# Altium schematic sheet [02] - BLOCK DIAGRAM.SchDoc
size A2; DocumentNumber: 2; SheetNumber: 2; SheetTotal: 5; PageSetup: Record=PageOptions|CenterHorizontal=True|CenterVertical=True|PrintScale=0.52|XCorrection=1.00|YCorrection=1.00|PrintKind=1|BorderSize=5000000|LeftOffset=0|BottomOffset=0|Orientation=2|PaperLength=1000|PaperWidth=1000|Scale=100|PaperSource=4|PrintQuality=600|MediaType=1|DitherType=10|PrintScaleMode=1|PaperKind=A4|PaperIndex=9
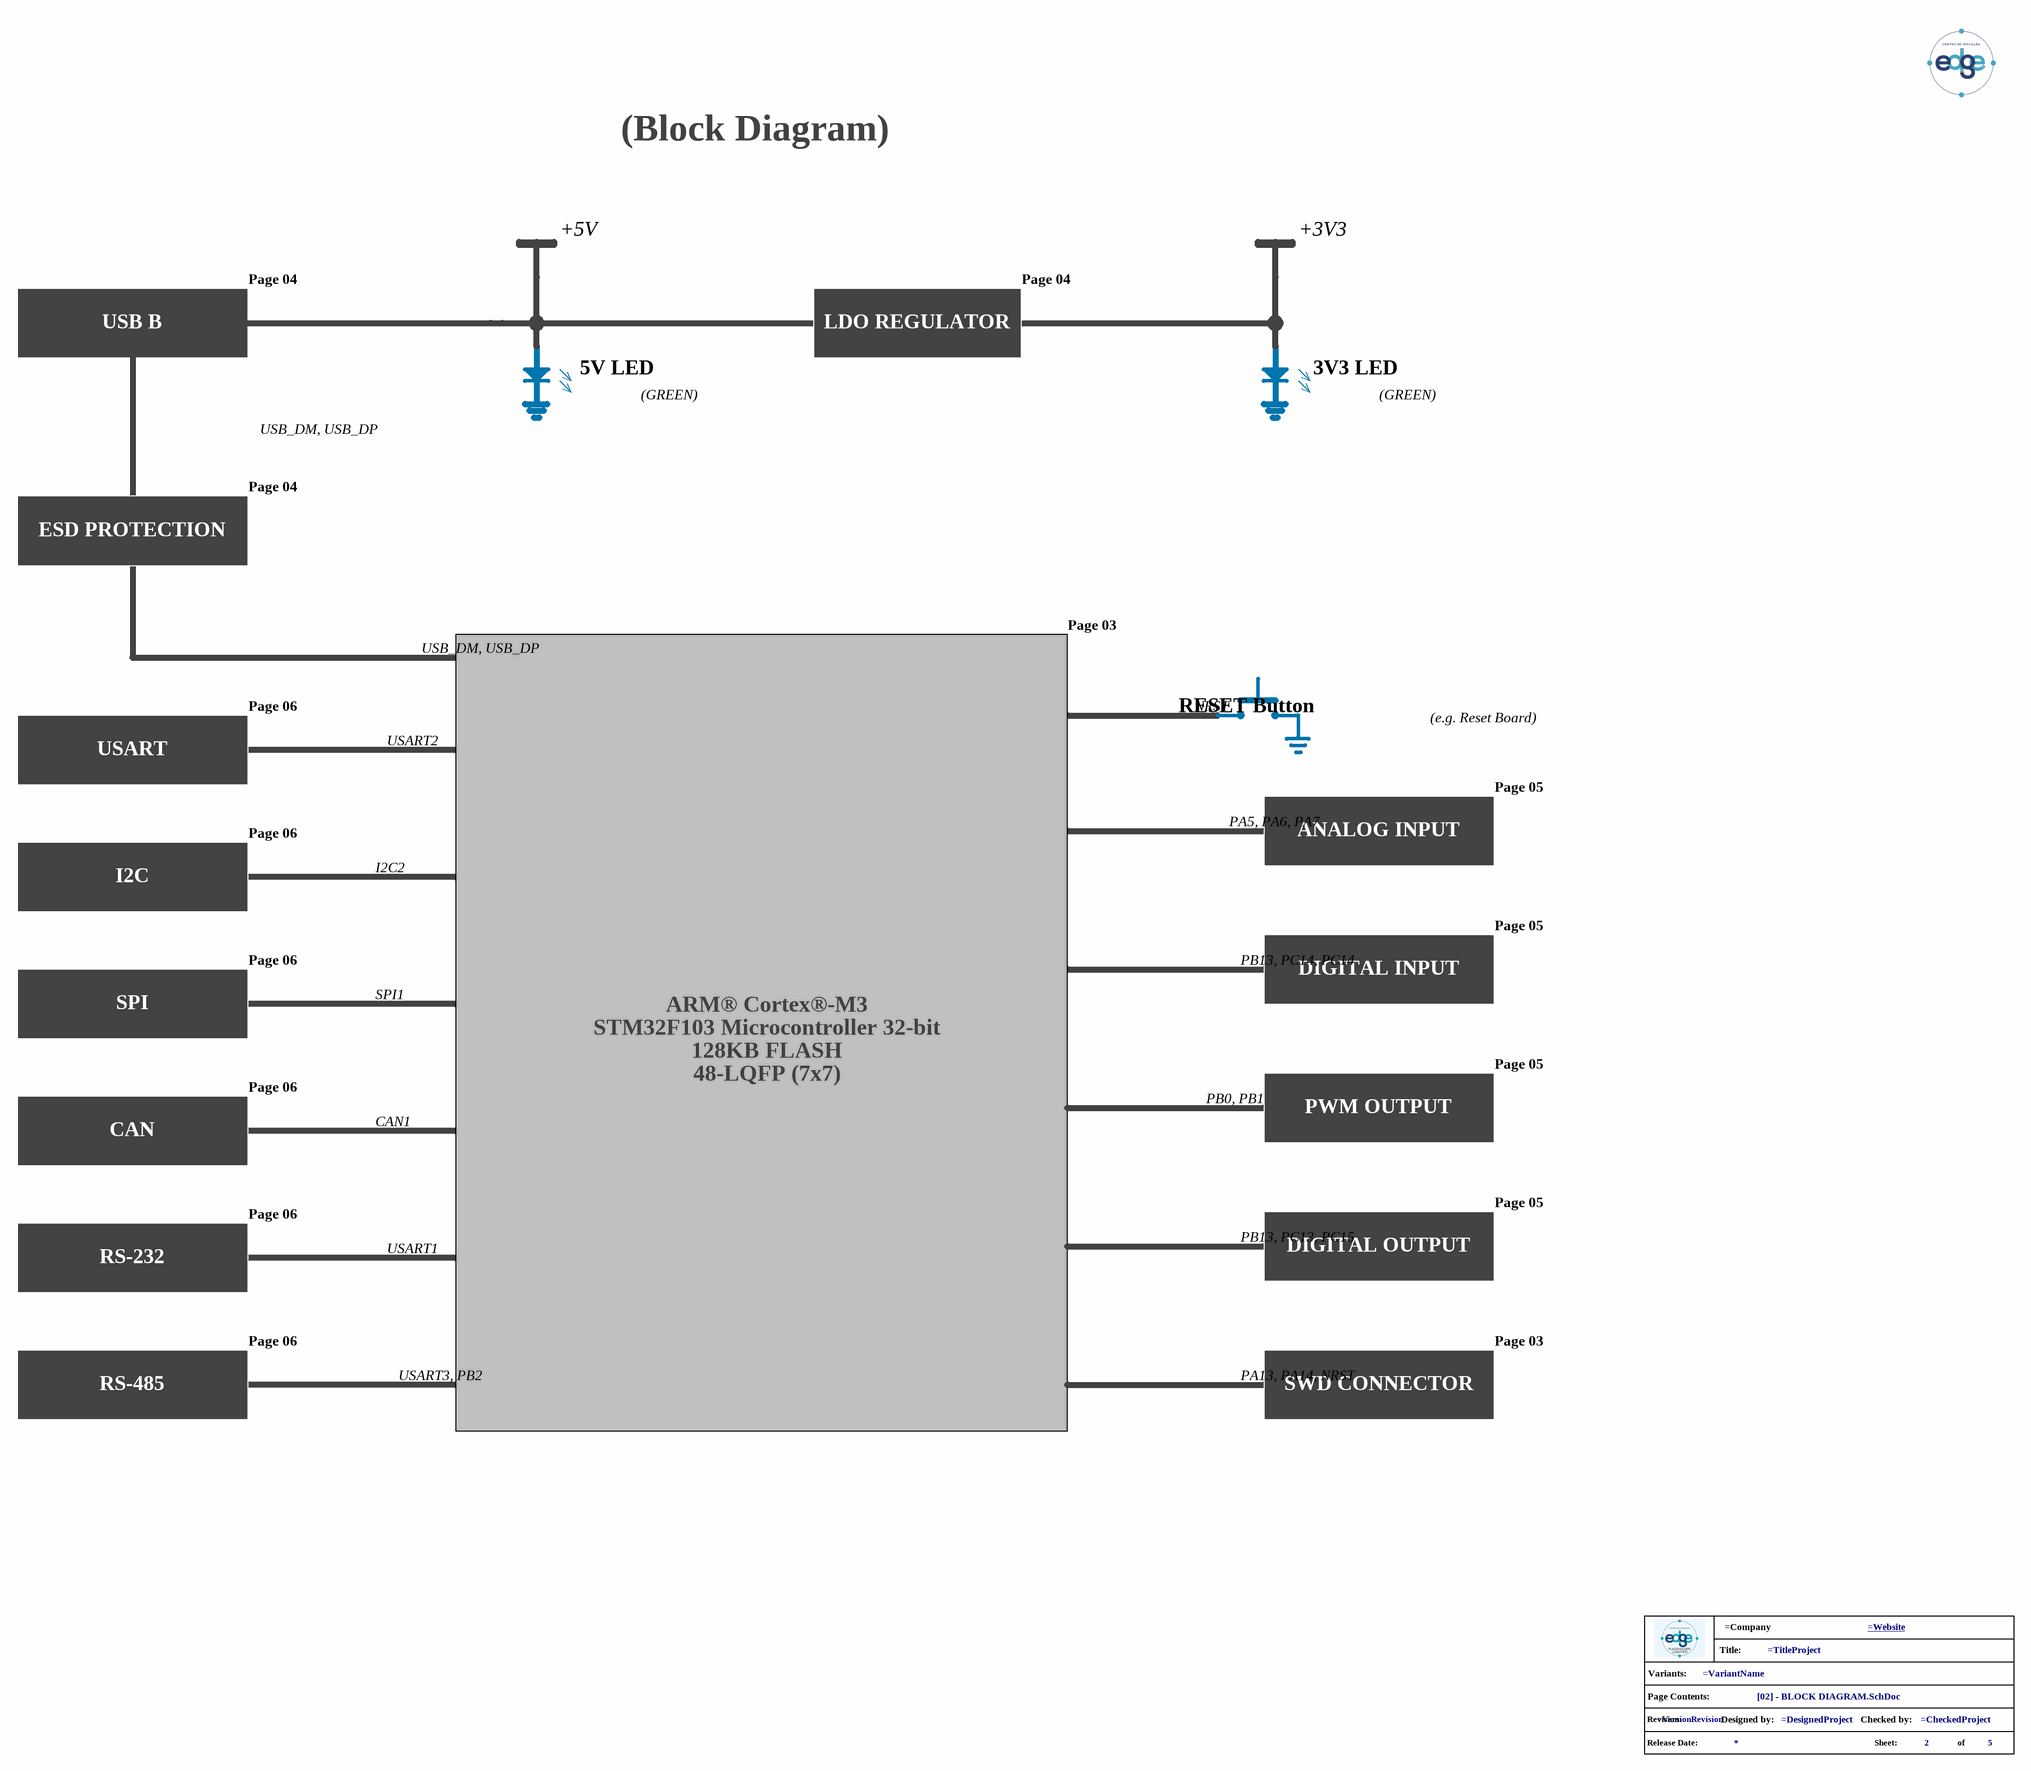
[diagram p0: [02] - BLOCK DIAGRAM.SchDoc]

## Parts
*?  info_project  (value not drawn)  (graphical)

## Notes on the sheet
- (Block Diagram)
- +5V
- +3V3
- Page 04
- USB B
- LDO REGULATOR
- 5V LED
- (GREEN)
- 3V3 LED
- USB_DM, USB_DP
- ESD PROTECTION
- Page 03
- Page 06
- NRST
- RESET Button
- USART
- USART2
- (e.g. Reset Board)
- PA5, PA6, PA7
- Page 05
- I2C
- I2C2
- ANALOG INPUT
- SPI1
- ARM® Cortex®-M3
- PB13, PC14, PC14
- DIGITAL INPUT
- SPI
- STM32F103 Microcontroller 32-bit
- 128KB FLASH
- 48-LQFP (7x7)
- PB0, PB1
- PWM OUTPUT
- CAN
- CAN1
- RS-232
- USART1
- PB13, PC13, PC15
- DIGITAL OUTPUT
- RS-485
- USART3, PB2
- PA13, PA14, NRST
- SWD CONNECTOR
- (in symbol info_project) Title:; Variants:; Page Contents:; Revision:; Designed by:; Checked by:; Release Date:; Sheet:; of

## Library data of the parts
*? = info_project: GRAPHICAL - Info Project